# EAGLE design 211_7seg_1_0_8 (EAGLE 9.6.0)
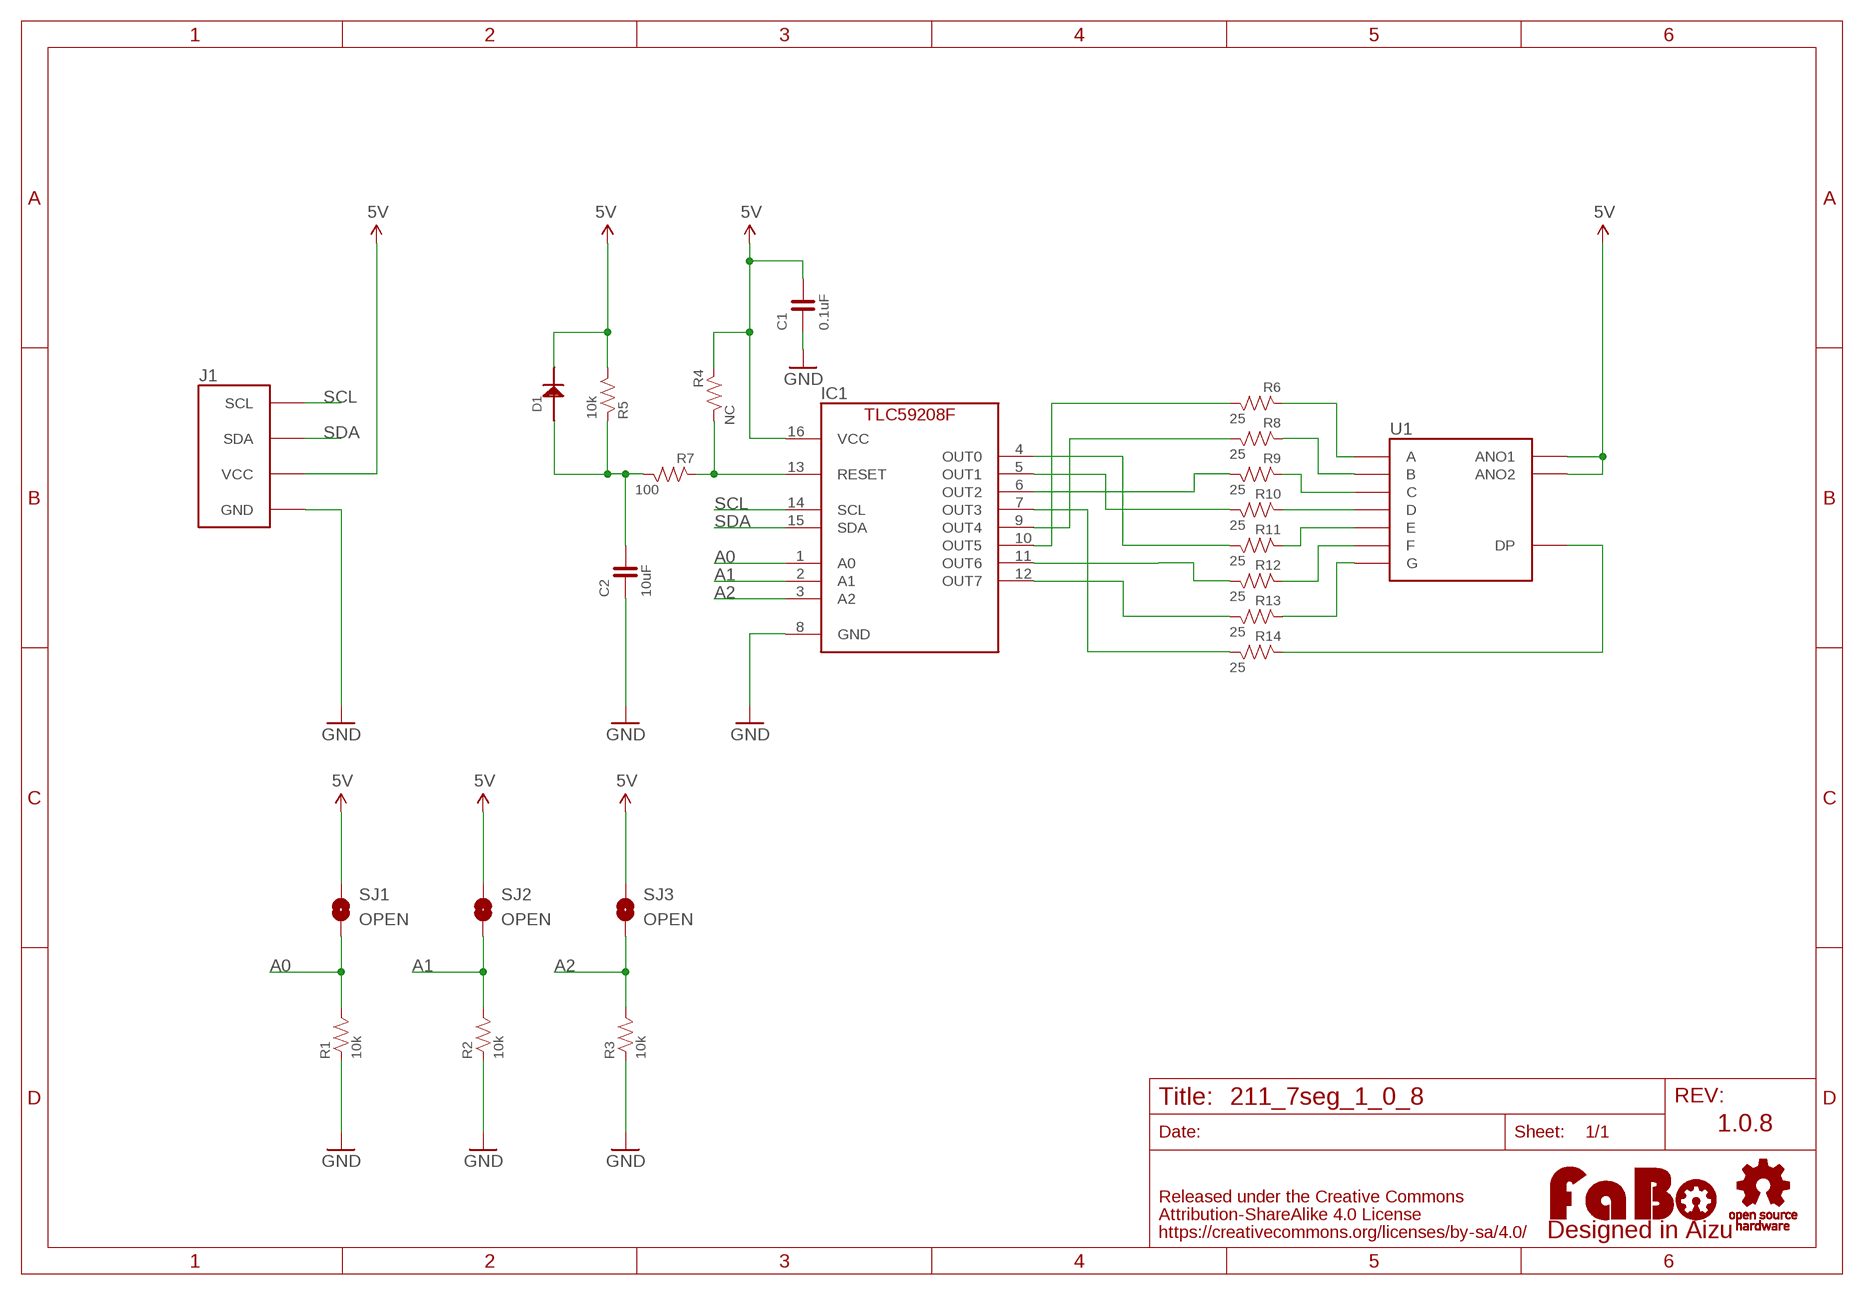
[diagram p0: schematic, sheet 1]

## Parts
C1  0.1uF  CAPACITOR-0603  [0603]
C2  10uF  CAPACITOR-0603  [0603]
D1  1N4148  [1N4148W]
IC1  TLC59208FIPWR  [TSSOP16]
J1  FABO_BRICK_I2C  [FABO_BRICK_I2C]
LOGO1  LOGO_FABO-M  [LOGO_FABO_M]
R1  10k  RESISTOR-0603  [0603]
R2  10k  RESISTOR-0603  [0603]
R3  10k  RESISTOR-0603  [0603]
R4  NC  RESISTOR-0603  [0603]
R5  10k  RESISTOR-0603  [0603]
R6  25  RESISTOR-0603  [0603]
R7  100  RESISTOR-0603  [0603]
R8  25  RESISTOR-0603  [0603]
R9  25  RESISTOR-0603  [0603]
R10  25  RESISTOR-0603  [0603]
R11  25  RESISTOR-0603  [0603]
R12  25  RESISTOR-0603  [0603]
R13  25  RESISTOR-0603  [0603]
R14  25  RESISTOR-0603  [0603]
SJ1  OPEN  SMD-JUMPER-2-OPEN  [SMD-JUMPER-2-OPEN]
SJ2  OPEN  SMD-JUMPER-2-OPEN  [SMD-JUMPER-2-OPEN]
SJ3  OPEN  SMD-JUMPER-2-OPEN  [SMD-JUMPER-2-OPEN]
U1  7SEG_ANO  [A-551SRD]
U$2  LOGO_OSHW-M_BOTTOM  [LOGO_OSHW_M_BOTTOM]

## Nets
5V: C1.2 D1.CATHODE IC1.16(VCC) J1.VCC R4.1 R5.2 SJ1.1 SJ2.1 SJ3.1 U1.ANO1 U1.ANO2
A0: IC1.1(A0) R1.2 SJ1.2
A1: IC1.2(A1) R2.2 SJ2.2
A2: IC1.3(A2) R3.2 SJ3.2
GND: C1.1 C2.1 IC1.8(GND) J1.GND R1.1 R2.1 R3.1
N$1: IC1.4(OUT0) R11.2
N$2: IC1.5(OUT1) R10.2
N$3: R9.1 U1.C
N$4: IC1.7(OUT3) R14.2
N$5: IC1.9(OUT4) R8.2
N$6: IC1.10(OUT5) R6.2
N$7: IC1.11(OUT6) R12.2
N$8: IC1.12(OUT7) R13.2
N$9: C2.2 D1.ANODE R5.1 R7.2
N$10: IC1.13(RESET) R4.2 R7.1
N$11: R6.1 U1.A
N$12: R8.1 U1.B
N$13: IC1.6(OUT2) R9.2
N$14: R10.1 U1.D
N$15: R11.1 U1.E
N$16: R12.1 U1.F
N$17: R13.1 U1.G
N$18: R14.1 U1.DP
SCL: IC1.14(SCL) J1.SCL
SDA: IC1.15(SDA) J1.SDA

## Notes on the sheet
- 1.0.8

## Library data of the parts
C1 C2 = FaBo-Capacitor:CAPACITOR: CAPACITOR
D1 = FaBo-Diode:1N4148
IC1 = FaBo-LED:TLC59208F
J1 = FaBo-Template:FABO_BRICK_I2C: FaBo Brick I2C
LOGO1 = component:LOGO_FABO
R1-R14 = FaBo-Resistors:RESISTOR: RESISTOR
SJ1-SJ3 = FaBo-Supply:SMD-JUMPER-2
U1 = FaBo-LED:7SEG_ANO
U$2 = FaBo-etc:LOGO_OSHW

## Board
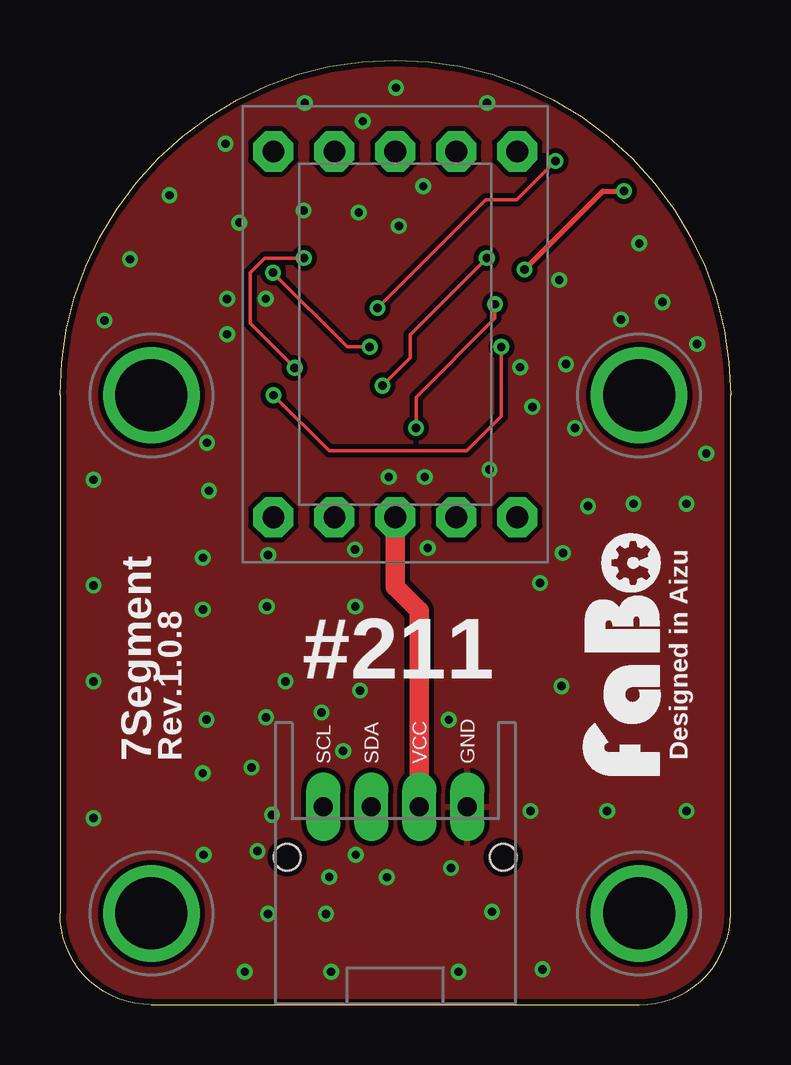
[diagram p1: board, top side]
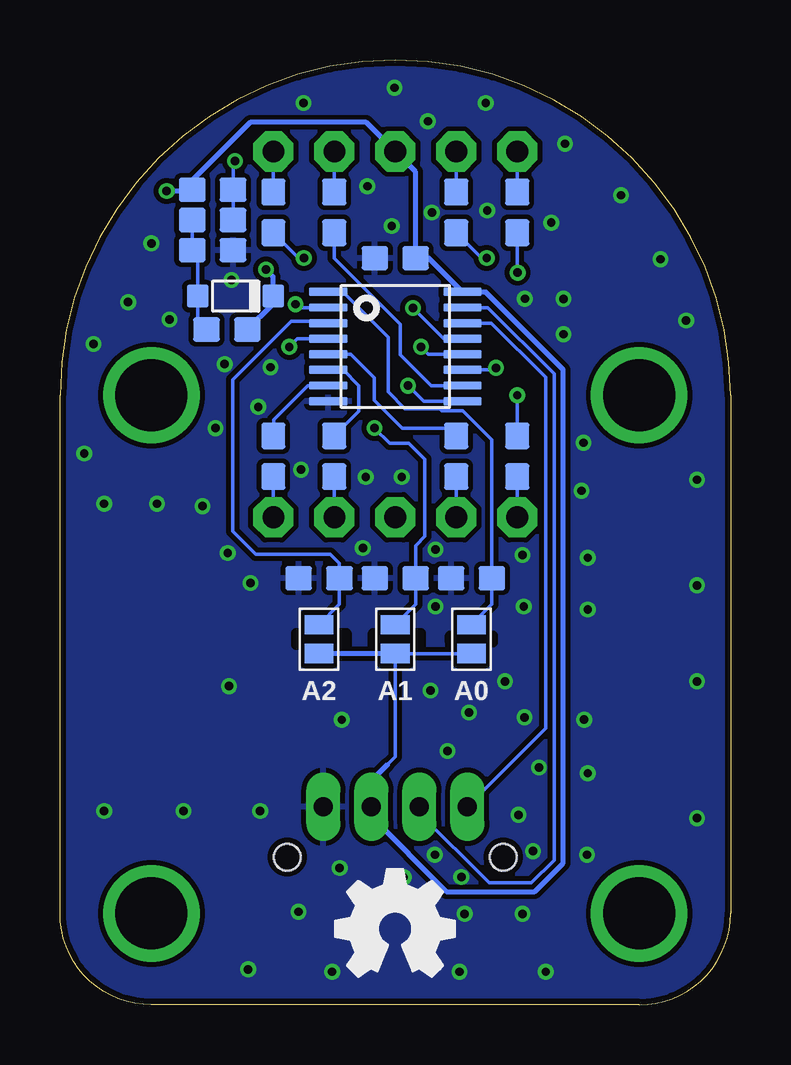
[diagram p2: board, bottom side, seen from below]

Size 27.94 x 39.37 mm. Coordinates in mm from the lower left corner, seen from the top.
Copper layers (1*16): Top 0.035mm / dielectric 1.6mm / Bottom 0.035mm
Design rules "PCBway": minimum track width 6mil, minimum drill 12mil, track to track 6mil, track to pad 6mil, pad to pad 6mil, via to via 6mil, smd to smd 6mil, copper to edge 10mil, drill to drill 10mil, minimum pad ring 10mil, minimum via ring 6mil, stop-mask expansion 2mil, vias tented up to drill 100mil, thermal gap 8mil
bRestrict: area 9.9,15.1 to 10.1,15.4; area 11.5,15.1 to 11.7,15.4; area 12.9,15 to 13.3,15.5; area 14.6,15 to 14.9,15.5; area 16,15 to 16.5,15.5; area 17.8,15 to 18.1,15.5

### Footprints (pad centres in the part's own frame; a part is rotated, then mirrored left to right if it is on the bottom)
0603 = smd 1.1 x 1: 1 -0.85,0; 2 0.85,0
1N4148W = smd 0.9 x 0.95: ANODE 0,0; CATHODE 3.15,0
TSSOP16 = smd 0.35 x 1.6: 1 -2.275,-2.8; 2 -1.625,-2.8; 3 -0.975,-2.8; 4 -0.325,-2.8; 5 0.325,-2.8; 6 0.975,-2.8; 7 1.625,-2.8; 8 2.275,-2.8; 9 2.275,2.8; 10 1.625,2.8; 11 0.975,2.8; 12 0.325,2.8; 13 -0.325,2.8; 14 -0.975,2.8; 15 -1.625,2.8; 16 -2.275,2.8
FABO_BRICK_I2C = drill 0.8 pad 1.422 long: GND 3,-10.795; SCL -3,-10.795; SDA -1,-10.795; VCC 1,-10.795 | drill 3 pad 3.81: P$1 -10.16,6.35; P$2 10.16,6.35; P$3 -10.16,-15.24; P$4 10.16,-15.24 | hole 1.1: -4.5,-12.895; 4.5,-12.895
SMD-JUMPER-2-OPEN = smd 0.8 x 1.2: 1 -0.6,0; 2 0.6,0
A-551SRD = drill 0.9 pad 1.676 octagon: A 2.54,7.62; ANO1 0,-7.62; ANO2 0,7.62; B 5.08,7.62; C 2.54,-7.62; D -2.54,-7.62; DP 5.08,-7.62; E -5.08,-7.62; F -2.54,7.62; G -5.08,7.62

### Placement (x,y rotation side)
C1  13.97,31.11 0 bottom
C2  21.58,31.45 180 bottom
D1  22.2,29.53 0 bottom
IC1  13.97,27.43 270 bottom
J1  13.97,19.05 0 top
LOGO1  25.4,14.61 90 top
R1  10.79,17.78 0 bottom
R2  13.97,17.78 0 bottom
R3  17.14,17.78 0 bottom
R4  21.58,33.97 0 bottom
R5  20.99,28.14 0 bottom
R6  16.51,33.02 270 bottom
R7  21.58,32.71 180 bottom
R8  19.05,33.02 270 bottom
R9  16.51,22.86 90 bottom
R10  11.43,22.86 90 bottom
R11  8.89,22.86 90 bottom
R12  11.43,33.02 270 bottom
R13  8.89,33.02 270 bottom
R14  19.05,22.86 90 bottom
SJ1  10.79,15.24 90 bottom
SJ2  13.97,15.24 90 bottom
SJ3  17.14,15.24 90 bottom
U1  13.97,27.94 0 top
U$2  13.97,3.17 0 top

### Tracks (layer width: path | path; a pad name or v marks a point on that pad's centre or on a via)
5V  (via drill 0.35)
  Top 0.203: v19.36,30.64 22.62,33.91 v23.5,33.91
  Top 0.813: J1.VCC 14.97,16.43 13.97,17.43 U1.ANO1
  Bottom 0.152: 22.58,33.97 R4.1 | 19.05,29.22 D1.CATHODE | SJ1.1 SJ2.1 13.97,10.33 14.3,10
  Bottom 0.203: D1.CATHODE 19.05,30.34 v19.36,30.64 | R5.2 19.05,29.22 | 22.58,33.97 22.58,34.2 20.01,36.77 15.18,36.77 U1.ANO2 13.12,34.71 C1.2 12.57,31.11 IC1.16 10.21,29.71 6.98,26.47 6.98,5.91 8.16,4.72 11.84,4.72 14.97,7.86 J1.VCC 14.97,9.33 14.3,10 | SJ2.1 SJ3.1 | R4.1 22.49,33.91 v23.5,33.91
A0
  Bottom 0.152: SJ1.2 9.95,16.69 R1.2 9.95,19.87 9.96,19.88 9.96,23.55 11.16,24.75 12.03,24.75 12.12,24.84 13.56,24.84 14.27,25.54 14.27,27.82 16.15,29.71 IC1.1
A1  (via drill 0.35)
  Top 0.152: v14.84,24.03 14.84,25.32 18.12,28.61 v18.12,29.19
  Bottom 0.152: SJ2.2 13.12,16.69 R2.2 13.12,19.14 12.74,19.52 12.74,22.73 13.41,23.4 14.21,23.4 v14.84,24.03 | v18.12,29.19 17.99,29.06 IC1.2
A2
  Bottom 0.152: SJ3.2 16.3,16.69 R3.2 16.3,18.39 16.68,18.78 19.78,18.78 20.74,19.74 20.74,23.55 20.74,26.05 18.3,28.48 16.85,28.48 IC1.3
GND  (via drill 0.35)
  other vias: 15.32,19.03 20,17.58 14.12,32.46 12.5,13.1 12.3,16.6 17.9,22.3 20.8,30.2 8.62,16.6 8.58,11.98 8.83,7.92 11.22,5.33 16.29,5.7 8.67,18.75 5.95,9.65 6.96,27.94 8.57,29.42 6.96,29.42 12.32,6.26 6.1,11.88 6.13,23.42 5.99,6.26 1.4,13.48 1.4,7.78 1.4,21.88 1.85,28.51 4.56,33.73 10.2,37.58 14,38.22 17.8,37.58 7.98,9.89 8.23,6.4 1.4,17.48 19.6,8.08 22.8,8.08 16.2,11.88 11.8,10.58 10.9,12.18 9.4,13.48 6.9,35.88 18,3.88 26.1,8.08 23.9,20.88 25.1,29.28 7.7,1.38 11.3,1.38 16.6,1.38 20.1,1.48 22,20.78 26.1,20.88 24.13,31.73 20.9,13.28 15.2,22 13.7,22 19.17,26.57 5.95,18.63 5.95,16.47 7.47,32.59 10.14,33.1 15.13,34.11 21.08,26.7 21.46,24.03 20.95,18.82 6.21,21.42 12.3,18.98 8.67,3.79 11.08,3.79 13.62,5.32 23.37,28.56 26.55,27.54 26.93,22.97 2.91,31.07 12.61,36.82 12.45,33.02 19.68,24.92
  pour Bottom (isolate 0.203): 0,0 27.94,0 27.94,39.37 0,39.37
  pour Top (isolate 0.203): 0,0 27.94,0 27.94,39.37 0,39.37
N$1  (via drill 0.35)
  Top 0.152: v8.89,25.4 11.21,23.08 16.95,23.08 18.39,24.52 v18.39,27.42
  Bottom 0.152: R11.2 v8.89,25.4 | v18.39,27.42 18.05,27.76 IC1.4
N$2
  Bottom 0.152: R10.2 11.74,24.02 13.67,24.02 14.84,25.18 14.84,26.13 15.82,27.11 IC1.5
N$3
  Bottom 0.152: U1.C R9.1
N$4
  Bottom 0.152: R14.2 19.03,23.73 19.03,24.38 17.61,25.81 IC1.7
N$5  (via drill 0.35)
  Top 0.152: v17.78,31.11 14.6,27.93 14.6,26.96 v13.44,25.8
  Bottom 0.152: R8.2 18,31.11 v17.78,31.11 | v13.44,25.8 12.79,25.16 IC1.9
N$6
  Bottom 0.152: R6.2 16.51,31.11 13.76,28.36 13.76,27.09 12.47,25.81 IC1.10
N$7  (via drill 0.35)
  Top 0.152: v10.16,31.11 8.53,31.11 7.93,30.51 7.93,28.39 v9.78,26.54
  Bottom 0.152: R12.2 10.38,31.11 v10.16,31.11 | IC1.11 9.87,26.46 v9.78,26.54
N$8  (via drill 0.35)
  Top 0.152: v8.87,30.51 11.96,27.42 v12.9,27.42
  Bottom 0.152: R13.2 8.89,30.53 v8.87,30.51 | v12.9,27.42 12.59,27.11 IC1.12
N$9
  Bottom 0.152: R7.2 C2.2 22.2,31.22 D1.ANODE 22.2,28.51 R5.1
N$10  (via drill 0.35)
  Top 0.152: v13.23,29.03 17.74,33.55 19.03,33.55 v20.64,35.16
  Bottom 0.152: IC1.13 11.95,27.76 v13.23,29.03 | v20.64,35.16 20.73,35.08 R4.2 R7.1
N$11
  Bottom 0.152: R6.1 U1.A
N$12
  Bottom 0.152: R8.1 U1.B
N$13
  Bottom 0.152: R9.2 15.48,24.74 15.48,25.81 16.13,26.46 IC1.6
N$14
  Bottom 0.152: U1.D R10.1
N$15
  Bottom 0.152: R11.1 U1.E
N$16
  Bottom 0.152: U1.F R12.1
N$17
  Bottom 0.152: R13.1 U1.G
N$18
  Bottom 0.152: U1.DP R14.1
SCL
  Bottom 0.152: J1.SCL 7.7,11.53 7.7,26.15 9.96,28.41 IC1.14
SDA
  Bottom 0.152: IC1.15 10.12,29.06 7.36,26.29 7.36,6.03 8.3,5.08 10.06,5.08 12.97,7.99 J1.SDA

### Text on the board
tPlace: Designed in Aizu | #211 | 7Segment | Rev.1.0.8
bPlace: A0 | A1 | A2